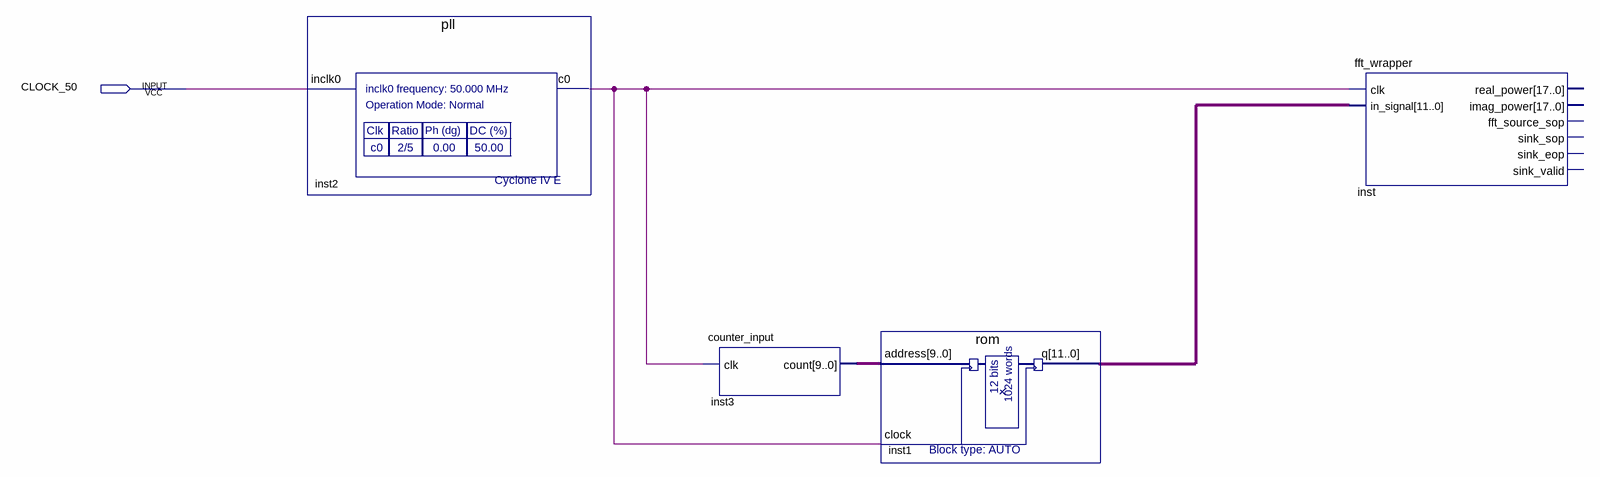
[diagram p0: schematic sheet]
// Quartus schematic miniproject_1024.bdf as structural Verilog: 4 symbols, 1 pins
module miniproject_1024 (
  input  CLOCK_50
);

  wire inst2_c0;
  wire [9:0] inst3_count;
  wire [11:0] inst1_q;

  pll inst2 (.inclk0(CLOCK_50), .c0(inst2_c0));
  counter_input inst3 (.clk(inst2_c0), .count(inst3_count));
  rom inst1 (.address(inst3_count), .clock(inst2_c0), .q(inst1_q));
  fft_wrapper inst (
    .clk(inst2_c0), .in_signal(inst1_q));  // open: real_power, imag_power, fft_source_sop, sink_sop, sink_eop, sink_valid
endmodule
